# EAGLE design LightingUPS_v3 (EAGLE 7.6.0)
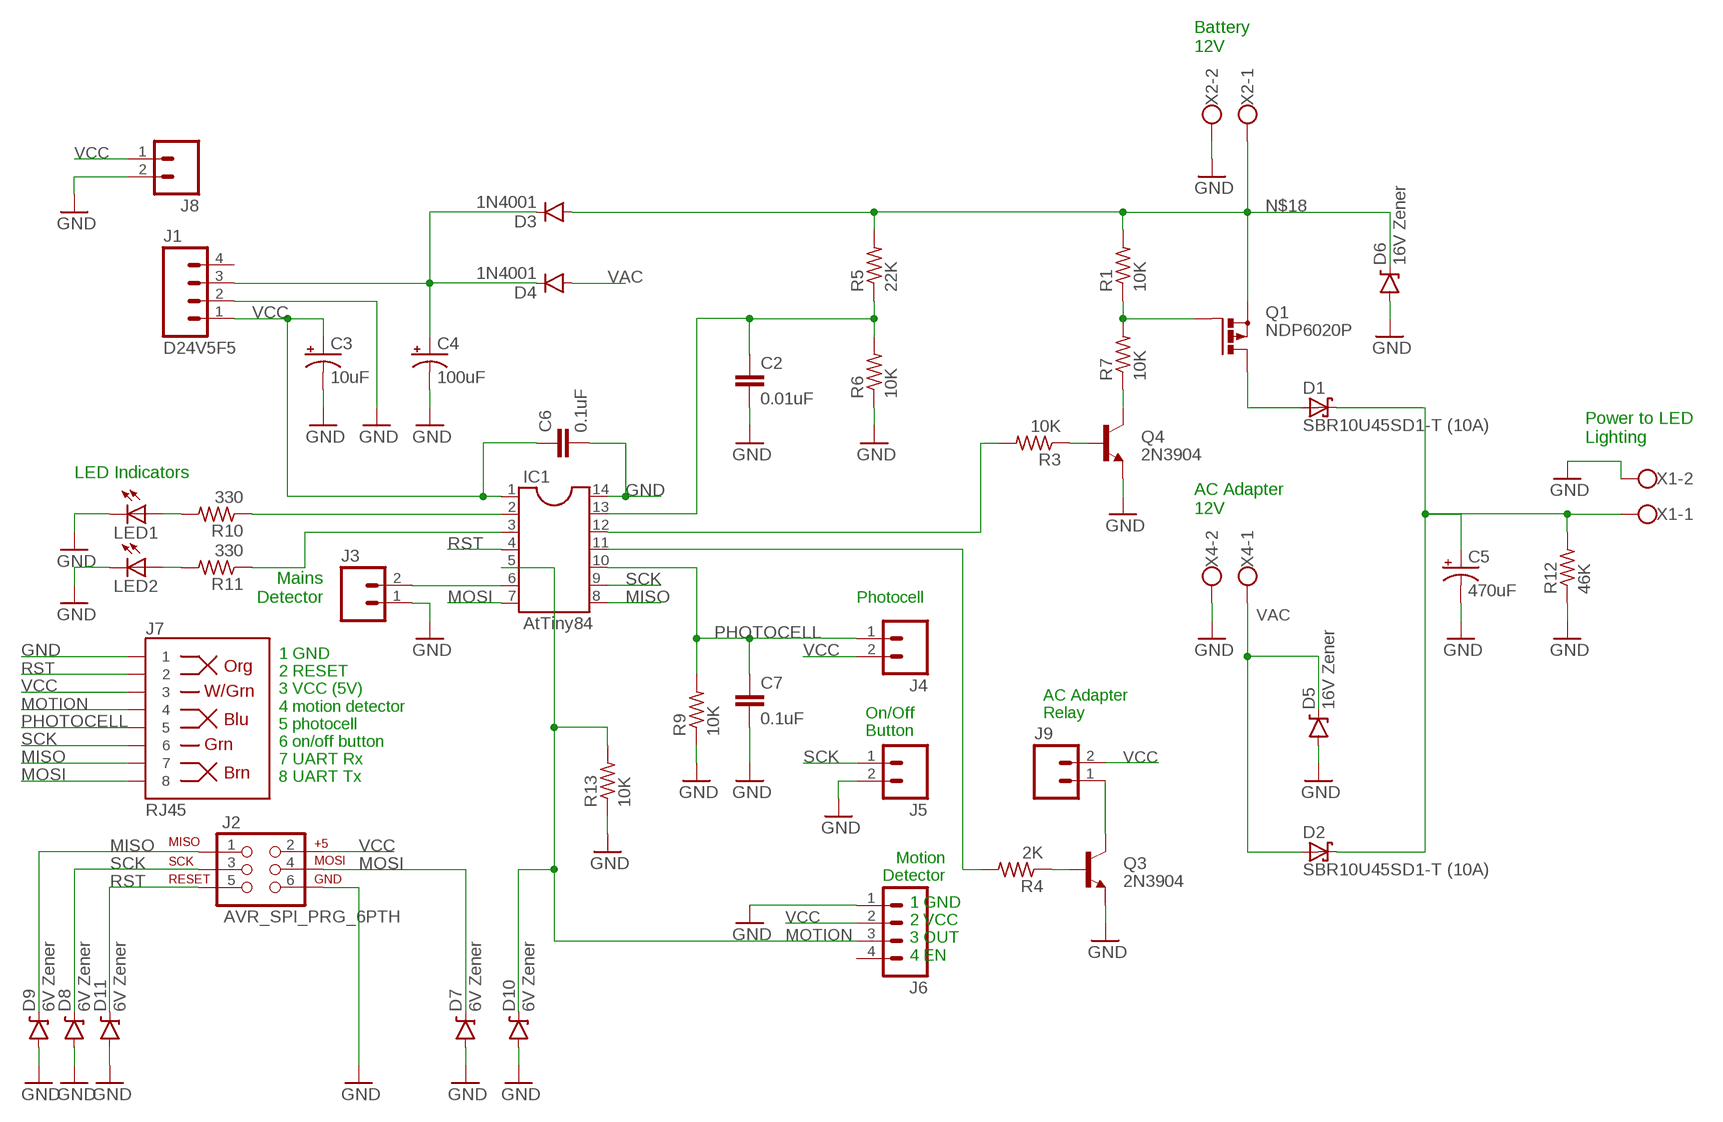
[diagram p0: schematic, sheet 1]

## Parts
C2  0.01uF  CAPPTH1  [CAP-PTH-5MM]
C3  10uF  CAP_POLPTH1  [CPOL-RADIAL-100UF-25V]
C4  100uF  CAP_POLPTH1  [CPOL-RADIAL-100UF-25V]
C5  470uF  CAP_POLPTH4  [CPOL-RADIAL-1000UF-25V]
C6  0.1uF  CAPPTH  [CAP-PTH-SMALL]
C7  0.1uF  CAPPTH  [CAP-PTH-SMALL]
D1  SBR10U45SD1-T (10A)  SCHOTTKY-DIODEDO201T15  [DO201T15]
D2  SBR10U45SD1-T (10A)  SCHOTTKY-DIODEDO201T15  [DO201T15]
D3  1N4001  DIODEPTH  [DIODE-1N4001]
D4  1N4001  DIODEPTH  [DIODE-1N4001]
D5  16V Zener  DIODE-ZENERPTH  [DIODE-ZENER]
D6  16V Zener  DIODE-ZENERPTH  [DIODE-ZENER]
D7  6V Zener  DIODE-ZENERPTH  [DIODE-ZENER]
D8  6V Zener  DIODE-ZENERPTH  [DIODE-ZENER]
D9  6V Zener  DIODE-ZENERPTH  [DIODE-ZENER]
D10  6V Zener  DIODE-ZENERPTH  [DIODE-ZENER]
D11  6V Zener  DIODE-ZENERPTH  [DIODE-ZENER]
IC1  AtTiny84  DIL14  [DIL14]
J1  D24V5F5  M04PTH  [1X04]
J2  AVR_SPI_PRG_6PTH  [2X3]
J3  M02PTH  [1X02]
J4  M02PTH  [1X02]
J5  M02PTH  [1X02]
J6  M04PTH  [1X04]
J7  RJ45  RJ45-8PTH  [RJ45-8]
J8  M02PTH  [1X02]
J9  M02PTH  [1X02]
LED1  LED5MM  [LED5MM]
LED2  LED5MM  [LED5MM]
Q1  NDP6020P  PMOSFET_PTO220BV  [TO220BV]
Q3  2N3904  TRANSISTOR_NPNTO-92-AMMO  [TO-92-AMMO]
Q4  2N3904  TRANSISTOR_NPNTO-92-AMMO  [TO-92-AMMO]
R1  10K  R-US_0204/5  [0204/5]
R3  10K  R-US_0204/5  [0204/5]
R4  2K  R-US_0204/5  [0204/5]
R5  22K  R-US_0204/5  [0204/5]
R6  10K  R-US_0204/5  [0204/5]
R7  10K  R-US_0204/5  [0204/5]
R9  10K  R-US_0204/5  [0204/5]
R10  330  R-US_0204/5  [0204/5]
R11  330  R-US_0204/5  [0204/5]
R12  46K  R-US_0204/5  [0204/5]
R13  10K  R-US_0204/5  [0204/5]
X1  W237-102  [W237-102]
X2  W237-102  [W237-102]
X4  W237-102  [W237-102]

## Nets
GND: C2.2 C3.2(-) C4.2(-) C5.- C6.2 C7.2 D5.P$2(A) D6.P$2(A) D7.P$2(A) D8.P$2(A) D9.P$2(A) D10.P$2(A) D11.P$2(A) IC1.14 J1.2 J2.6 J3.1 J5.2 J6.1 J7.1 J8.2 LED1.K(C) LED2.K(C) Q3.1(E) Q4.1(E) R6.1 R9.1 R12.1 R13.1 X1.2 X2.2 X4.2
MISO: D9.P$1(C) IC1.8 J2.1 J7.7
MOSI: D7.P$1(C) IC1.7 J2.4 J7.8
MOTION: D10.P$1(C) IC1.5 J6.3 J7.4 R13.2
N$1: LED1.A R10.2
N$2: Q1.G R1.1 R7.2
N$3: Q4.2(B) R3.1
N$4: D1.A Q1.D
N$5: C5.+ D1.C D2.C R12.2 X1.1
N$6: C2.1 IC1.13 R5.1 R6.2
N$7: IC1.6 J3.2
N$8: IC1.11 R4.2
N$10: Q3.2(B) R4.1
N$12: IC1.12 R3.2
N$13: C4.1(+) D3.C D4.C J1.3
N$14: Q4.3(C) R7.1
N$15: IC1.2 R10.1
N$16: IC1.3 R11.1
N$17: LED2.A R11.2
N$18: D3.A D6.P$1(C) Q1.S R1.2 R5.2 X2.1
N$19: J9.1 Q3.3(C)
PHOTOCELL: C7.1 IC1.10 J4.1 J7.5 R9.2
RST: D11.P$1(C) IC1.4 J2.5 J7.2
SCK: D8.P$1(C) IC1.9 J2.3 J5.1 J7.6
VAC: D2.A D4.A D5.P$1(C) X4.1
VCC: C3.1(+) C6.1 IC1.1 J1.1 J2.2 J4.2 J6.2 J7.3 J8.1 J9.2
Unconnected: J1.4 J6.4

## Notes on the sheet
- Battery
  12V
- Power to LED
  Lighting
- LED Indicators
- AC Adapter
  12V
- Mains
  Detector
- Photocell
- 1 GND
  2 RESET
  3 VCC (5V)
  4 motion detector
  5 photocell
  6 on/off button
  7 UART Rx
  8 UART Tx
- AC Adapter
  Relay
- On/Off
  Button
- Motion
  Detector
- 1 GND
  2 VCC
  3 OUT
  4 EN

## Library data of the parts
C2 = SparkFun-Passives:CAP: Capacitor Standard 0603 ceramic capacitor, and 0.1" leaded capacitor.
C3-C5 = SparkFun-Capacitors:CAP_POL: Capacitor Polarized These are standard SMD and PTH capacitors. Normally 10uF, 47uF, and 100uF in electrolytic and tantalum varieties. Always verify the external diameter of the through hole cap, it varies with capacity, voltage, and manufacturer. The EIA devices should be standard.
C6 C7 = SparkFun-Capacitors:CAP: Capacitor Standard 0603 ceramic capacitor, and 0.1" leaded capacitor.
D1 D2 = adafruit:SCHOTTKY-DIODE: Schottky Diode
D3 D4 = SparkFun-DiscreteSemi:DIODE: Diode These are standard reverse protection diodes and small signal diodes. SMA package can handle up to about 1A. SOD-323 can handle about 200mA. What the SOD-323 package when ordering, there are some mfgs out there that are 5-pin packages.
D5-D11 = SparkFun-DiscreteSemi:DIODE-ZENER: Zener Diode Production Part - 8199 3.4V Zener Voltage
IC1 = ic-package:DIL14: Dual In Line / Socket
J1 J6 = SparkFun-Connectors:M04: Header 4 Standard 4-pin 0.1" header. Use with straight break away headers (SKU : PRT-00116), right angle break away headers (PRT-00553), swiss pins (PRT-00743), machine pins (PRT-00117), and female headers (PRT-00115). Molex polarized connector foot print use with SKU : PRT-08231 with associated crimp pins and housings. 1MM SMD Version SKU: PRT-10208; PROD_ID: CONN-09696
J2 = SparkFun-Connectors:AVR_SPI_PRG_6: AVR ISP 6 Pin This is the reduced ISP connector for AVR programming. Common on Arduino. This footprint will take up less PCB space and can be used with a 10-pin to 6-pin adapter such as SKU: BOB-08508 **Special note about "TEST_POINT" package. The stop mask is on the top side, so if you want your programming test points to be on the bottom of your board, make sure to place this package on the bottom side of the board. This also ensure that the orientation to program from the bottom side will be correct.
J3-J5 J8 J9 = SparkFun-Connectors:M02: Standard 2-pin 0.1" header. Use with - straight break away headers ( PRT-00116) - right angle break away headers (PRT-00553) - swiss pins (PRT-00743) - machine pins (PRT-00117) - female headers (PRT-00115) Molex polarized connector foot print use with: PRT-08233 with associated crimp pins and housings. 2.54_SCREWTERM for use with PRT-10571. 3.5mm Screw Terminal footprints for PRT-08084 5mm Screw Terminal footprints for use with PRT-08432
J7 = SparkFun-Connectors:RJ45-8: RJ45 Jack Simple RJ45, 8-pin connection - connector for common Cat5, Cat5e, and Cat6 Ethernet cables. Footprint not yet proven in production. Connector sku is PRT-00643; Breakout PCB sku is BOB-00716.; PROD_ID: CONN-08506
LED1 LED2 = adafruit:LED: LED OSRAM: - CHIPLED LG R971, LG N971, LY N971, LG Q971, LY Q971, LO R971, LY R971 LH N974, LH R974 LS Q976, LO Q976, LY Q976 LO Q996 - Hyper CHIPLED LW Q18S LB Q993, LB Q99A, LB R99A - SideLED LS A670, LO A670, LY A670, LG A670, LP A670 LB A673, LV A673, LT A673, LW A673 LH A674 LY A675 LS A676, LA A676, LO A676, LY A676, LW A676 LS A679, LY A679, LG A679 - Hyper Micro SIDELED® LS Y876, LA Y876, LO Y876, LY Y876 LT Y87S - SmartLED LW L88C, LW L88S LB L89C, LB L89S, LG L890 LS L89K, LO L89K, LY L89K LS L896, LA L896, LO L896, LY L896 - TOPLED LS T670, LO T670, LY T670, LG T670, LP T670 LSG T670, LSP T670, LSY T670, LOP T670, LYG T670 LG T671, LOG T671, LSG T671 LB T673, LV T673, LT T673, LW T673 LH T674 LS T676, LA T676, LO T676, LY T676, LB T676, LH T676, LSB T676, LW T676 LB T67C, LV T67C, LT T67C, LS T67K, LO T67K, LY T67K, LW E67C LS E67B, LA E67B, LO E67B, LY E67B, LB E67C, LV E67C, LT E67C LW T67C LS T679, LY T679, LG T679 LS T770, LO T770, LY T770, LG T770, LP T770 LB T773, LV T773, LT T773, LW T773 LH T774 LS E675, LA E675, LY E675, LS T675 LS T776, LA T776, LO T776, LY T776, LB T776 LHGB T686 LT T68C, LB T68C - Hyper Mini TOPLED® LB M676 - Mini TOPLED Santana® LG M470 LS M47K, LO M47K, LY M47K Source: http://www.osram.convergy.de/
Q1 = transistor-power:PMOSFET_P: Power MOSFET P-Channel
Q3 Q4 = SparkFun-DiscreteSemi:TRANSISTOR_NPN: Generic NPN BJT MMBT2222A - TRANS-08049 (SOT-23, 1A 40V) MPSA42 - TRANS-09116 (SOT-23, 500mA 300V) MMBT5088LT1G - TRANS-11160 (SOT-23, 50 mA 30V) BC547 - COM-08928 <http://www.sparkfun.com/products/8928> (TO-92 45V 100mA) (1.Collector 2.Base 3.Emitter) 2N3904 - COM-00521 <http://www.sparkfun.com/products/521> (TO-92 40V 200mA) (1.Emitter 2.Base 3.Collector) P2N2222A - COM-12852 <http://www.sparkfun.com/products/12852> (TO-92 40V 600mA) (1.Collector 2.Base 3.Emitter)
R1 R3-R7 R9-R13 = resistor:R-US_: RESISTOR, American symbol
X1 X2 X4 = con-wago-500:W237-102: WAGO SCREW CLAMP; MPN: 237-102; OC_FARNELL: unknown; OC_NEWARK: 70K9898

## Board
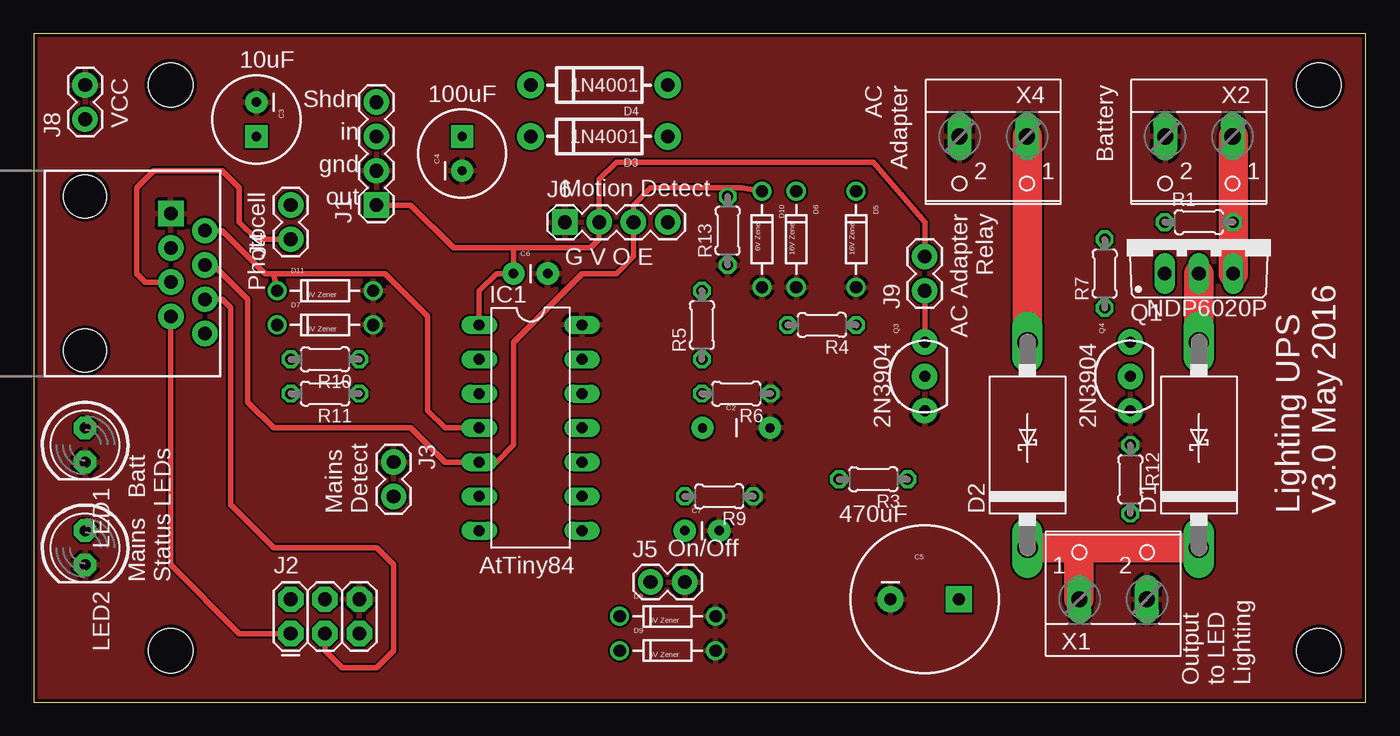
[diagram p1: board, top side]
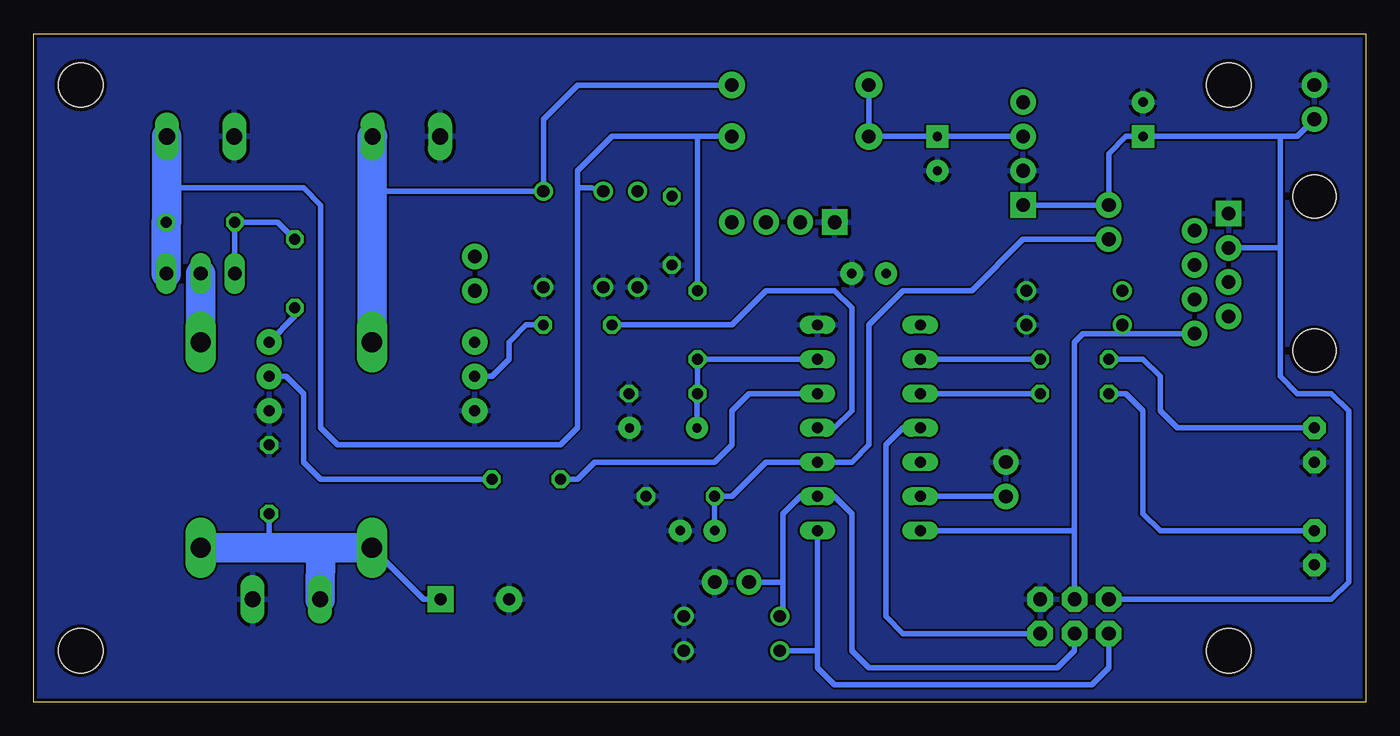
[diagram p2: board, bottom side, seen from below]

Size 98.73 x 49.52 mm. Coordinates in mm from the lower left corner, seen from the top.
Outline: 0,0 98.73,0 98.73,49.52 0,49.52 0,0
Copper layers (1*16): Top 0.035mm / dielectric 1.5mm / Bottom 0.035mm
Design rules "SeeedStudio_2layer_DRU_no_angle_20140221": minimum track width 6mil, minimum drill 12mil, track to track 6mil, track to pad 6mil, pad to pad 6mil, via to via 6mil, smd to smd 0mil, copper to edge 10mil, drill to drill 10mil, minimum pad ring 10mil, minimum via ring 6mil, stop-mask expansion 2mil, vias tented up to drill 100mil, thermal gap 10mil

### Footprints (pad centres in the part's own frame; a part is rotated, then mirrored left to right if it is on the bottom)
CAP-PTH-5MM = drill 0.7 pad 1.651: 1 -2.5,0; 2 2.5,0
CPOL-RADIAL-100UF-25V = drill 0.7 pad 1.651 square: 1 1.27,0 | drill 0.7 pad 1.651: 2 -1.27,0
CPOL-RADIAL-1000UF-25V = drill 0.9 pad 1.93 square: + 2.54,0 | drill 0.9 pad 1.93: - -2.54,0
CAP-PTH-SMALL = drill 0.7 pad 1.651: 1 0,0; 2 2.54,0
DO201T15 = drill 1.499 long: A 7.62,0; C -7.62,0
DIODE-1N4001 = drill 1 pad 1.981: A -5.08,0; C 5.08,0
DIODE-ZENER = drill 0.9: P$1 -3.556,0; P$2 3.556,0
DIL14 = drill 0.813 long: 1 -7.62,-3.81; 2 -5.08,-3.81; 3 -2.54,-3.81; 4 0,-3.81; 5 2.54,-3.81; 6 5.08,-3.81; 7 7.62,-3.81; 8 7.62,3.81; 9 5.08,3.81; 10 2.54,3.81; 11 0,3.81; 12 -2.54,3.81; 13 -5.08,3.81; 14 -7.62,3.81
1X04 = drill 1.016 pad 1.88 square: 1 0,0 | drill 1.016 pad 1.88: 2 2.54,0; 3 5.08,0; 4 7.62,0
2X3 = drill 1.016 pad 1.88 octagon: 1 0,0; 2 0,2.54; 3 2.54,0; 4 2.54,2.54; 5 5.08,0; 6 5.08,2.54
1X02 = drill 1.016 pad 1.88: 1 0,0; 2 2.54,0
RJ45-8 = drill 1 pad 1.88 square: 1 -4.445,6.35 | drill 1 pad 1.88: 2 -3.175,8.89; 3 -1.905,6.35; 4 -0.635,8.89; 5 0.635,6.35; 6 1.905,8.89; 7 3.175,6.35; 8 4.445,8.89 | hole 3.2: -5.715,0; 5.715,0
LED5MM = drill 0.813 pad 1.676 octagon: A -1.27,0; K 1.27,0
TO220BV = drill 1.016 long: D 0,-2.54; G -2.54,-2.54; S 2.54,-2.54
TO-92-AMMO = drill 0.813 pad 1.88: 1 -2.54,0; 2 0,0; 3 2.54,0
0204/5 = drill 0.813 octagon: 1 -2.54,0; 2 2.54,0
STAND-OFF = hole 3.302: 0,0
W237-102 = drill 1.194 long: 1 -2.5,-1.27; 2 2.5,-1.27

### Placement (x,y rotation side)
C2  52.07,20.32 0 top
C3  16.51,43.18 270 top
C4  31.75,40.64 90 top
C5  66.04,7.62 0 top
C6  35.56,31.75 0 top
C7  48.26,12.7 0 top
D1  86.36,19.05 90 top
D2  73.66,19.05 90 top
D3  41.91,41.91 180 top
D4  41.91,45.72 180 top
D5  60.96,34.29 270 top
D6  56.52,34.29 270 top
D7  21.59,27.94 0 top
D8  46.99,6.35 0 top
D9  46.99,3.81 0 top
D10  53.98,34.29 270 top
D11  21.59,30.48 0 top
IC1  36.83,20.32 270 top
J1  25.4,36.83 90 top
J2  19.05,5.08 0 top
J3  26.67,17.78 270 top
J4  19.05,34.29 90 top
J5  45.72,8.89 0 top
J6  39.37,35.56 0 top
J7  3.81,31.75 270 top
J8  3.81,43.18 90 top
J9  66.04,30.48 90 top
LED1  3.81,19.05 270 top
LED2  3.81,11.43 270 top
Q1  86.36,34.29 0 top
Q3  66.04,24.13 90 top
Q4  81.28,24.13 90 top
R1  86.36,35.56 0 top
R3  62.23,16.51 180 top
R4  58.42,27.94 180 top
R5  49.53,27.94 90 top
R6  52.07,22.86 180 top
R7  79.38,31.75 90 top
R9  50.8,15.24 180 top
R10  21.59,25.4 180 top
R11  21.59,22.86 180 top
R12  81.28,16.51 270 top
R13  51.44,34.92 90 top
U$1  [STAND-OFF]  10.16,3.81 0 top
U$2  [STAND-OFF]  95.25,3.81 0 top
U$3  [STAND-OFF]  10.16,45.72 0 top
U$4  [STAND-OFF]  95.25,45.72 0 top
X1  80.01,8.89 0 top
X2  86.36,40.64 180 top
X4  71.12,40.64 180 top

### Tracks (layer width: path | path; a pad name or v marks a point on that pad's centre or on a via)
GND
  pour Bottom: 0,0 0,49.53 99.06,49.53 99.06,0
  pour Top: 0,0 0,49.53 99.06,49.53 99.06,0
MISO
  Top 0.406: J7.7 10.16,10.16 15.24,5.08 J2.1
  Bottom 0.406: IC1.8 40.64,3.81 | 40.64,3.81 40.64,2.54 39.37,1.27 20.32,1.27 19.05,2.54 J2.1 | D9.P$1 40.64,3.81
MOSI
  Bottom 0.406: J7.8 17.78,27.3 | 17.78,27.3 20.95,27.3 21.59,26.67 21.59,12.7 | 21.59,12.7 J2.4 | IC1.7 21.59,12.7 | D7.P$1 17.78,27.3
MOTION
  Top 0.406: J7.4 13.34,32.38 15.88,29.84 15.88,22.23 17.78,20.32 27.94,20.32 30.48,17.78 IC1.5 34.29,17.78 35.56,19.05 35.56,26.67 40.64,31.75 43.18,31.75 44.45,33.02 J6.3 44.45,36.83 45.72,38.1 51.44,38.1 | 51.44,38.1 52.45,38.1 D10.P$1 | R13.2 51.44,38.1
N$1
  Bottom 0.406: LED1.A 13.97,20.32 15.24,21.59 15.24,24.13 16.51,25.4 R10.2
N$2
  Bottom 0.406: R7.2 80.64,35.56 R1.1 Q1.G
N$3
  Bottom 0.406: R3.1 77.47,16.51 78.74,17.78 78.74,22.86 80.01,24.13 Q4.2
N$4
  Top 2.184: Q1.D D1.A
  Bottom 2.184: D1.A Q1.D
N$5
  Top 2.184: D2.C 77.47,11.43 | 77.47,11.43 D1.C | 77.47,7.62 77.47,11.43
  Bottom 0.406: C5.+ 69.85,7.62 D2.C | R12.2 81.28,11.43
  Bottom 2.184: D2.C 77.47,11.43 | 77.47,11.43 81.28,11.43 D1.C | X1.1 77.51,7.58 77.47,11.43
N$6
  Bottom 0.406: IC1.13 R5.1 R6.2 49.57,22.86 C2.1
N$7
  Bottom 0.406: IC1.6 J3.2
N$8
  Bottom 0.406: IC1.11 39.37,20.32 38.1,21.59 38.1,29.21 39.37,30.48 44.45,30.48 46.99,27.94 R4.2
N$10
  Bottom 0.406: R4.1 62.23,27.94 63.5,26.67 63.5,25.4 64.77,24.13 Q3.2
N$12
  Bottom 0.406: IC1.12 45.72,22.86 46.99,21.59 46.99,19.05 48.26,17.78 57.15,17.78 58.42,16.51 R3.2
N$13
  Bottom 0.406: J1.3 C4.1 D3.C D4.C
N$14
  Bottom 0.406: R7.1 79.38,28.57 Q4.3
N$15
  Bottom 0.406: IC1.2 R10.1
N$16
  Bottom 0.406: R11.1 IC1.3
N$17
  Bottom 0.406: LED2.A 15.24,12.7 16.51,13.97 16.51,21.59 17.78,22.86 R11.2
N$18
  Top 2.184: 88.9,41.91 Q1.S
  Bottom 0.406: D3.A 49.53,41.91 | 58.42,38.1 58.42,39.37 55.88,41.91 49.53,41.91 | 58.42,38.1 58.42,20.32 59.69,19.05 76.2,19.05 77.47,20.32 77.47,36.83 78.74,38.1 88.86,38.1 | R5.2 49.53,41.91 | 58.42,38.1 57.4,38.1 D6.P$1
  Bottom 2.184: Q1.S R1.2 88.86,35.6 88.86,38.1 X2.1
N$19
  Top 0.406: J9.1 Q3.3
PHOTOCELL
  Top 0.406: J4.1 16.51,34.29 15.24,35.56 15.24,38.1 13.97,39.37 8.89,39.37 7.62,38.1 7.62,31.75 8.26,31.11 J7.5
  Bottom 0.406: C7.1 R9.2 46.99,15.24 44.45,17.78 IC1.10 38.1,17.78 36.83,19.05 36.83,27.94 34.29,30.48 29.21,30.48 25.4,34.29 J4.1
RST
  Top 0.406: IC1.4 30.48,20.32 29.21,21.59 29.21,28.57 26.04,31.75 17.78,31.75 | 17.78,31.75 17.14,31.75 13.97,34.92 J7.2 | D11.P$1 17.78,31.75
  Bottom 0.406: IC1.4 34.29,20.32 35.56,19.05 35.56,6.35 34.29,5.08 J2.5
SCK
  Top 0.406: J7.6 13.97,29.84 14.61,29.21 14.61,14.61 17.78,11.43 25.4,11.43 26.67,10.16 26.67,3.81 25.4,2.54 22.86,2.54 21.59,3.81 J2.3
  Bottom 0.406: 43.18,8.89 43.18,13.97 41.91,15.24 IC1.9 39.37,15.24 38.1,13.97 38.1,3.81 36.83,2.54 22.86,2.54 21.59,3.81 J2.3 | 43.18,8.89 43.18,6.6 D8.P$1 | J5.1 43.18,8.89
VAC
  Top 2.184: D2.A 73.66,41.91
  Bottom 0.406: D4.A 58.42,45.72 60.96,43.18 D5.P$1 73.41,37.85 73.66,38.1
  Bottom 2.184: D2.A 73.66,38.1 73.66,41.87 X4.1
VCC
  Top 0.406: J1.1 27.94,36.83 31.11,33.66 35.56,33.66 | 35.56,33.66 41.27,33.66 41.91,34.29 J6.2 41.91,38.73 43.18,40.01 62.23,40.01 66.04,35.56 J9.2 | 35.56,33.66 C6.1 34.29,31.75 33.02,30.48 IC1.1
  Bottom 0.406: J2.2 2.54,7.62 1.27,8.89 1.27,21.59 2.54,22.86 5.08,22.86 6.35,24.13 6.35,33.66 | J7.3 6.35,33.66 | J1.1 J4.2 19.05,40.64 17.78,41.91 C3.1 6.35,41.91 | J8.1 5.08,41.91 6.35,41.91 | 6.35,33.66 6.35,41.91

### Text on the board
tPlace: 10uF | AC / Adapter | Battery | 100uF | VCC | Motion Detect | Shdn / in / gnd / out | AC Adapter / Relay | G V O E | Photocell | NDP6020P | 2N3904 | 2N3904 | Mains / Detect | Lighting UPS / V3.0 May 2016 | 470uF | On/Off | AtTiny84 | Mains Batt / Status LEDs | Output / to LED / Lighting